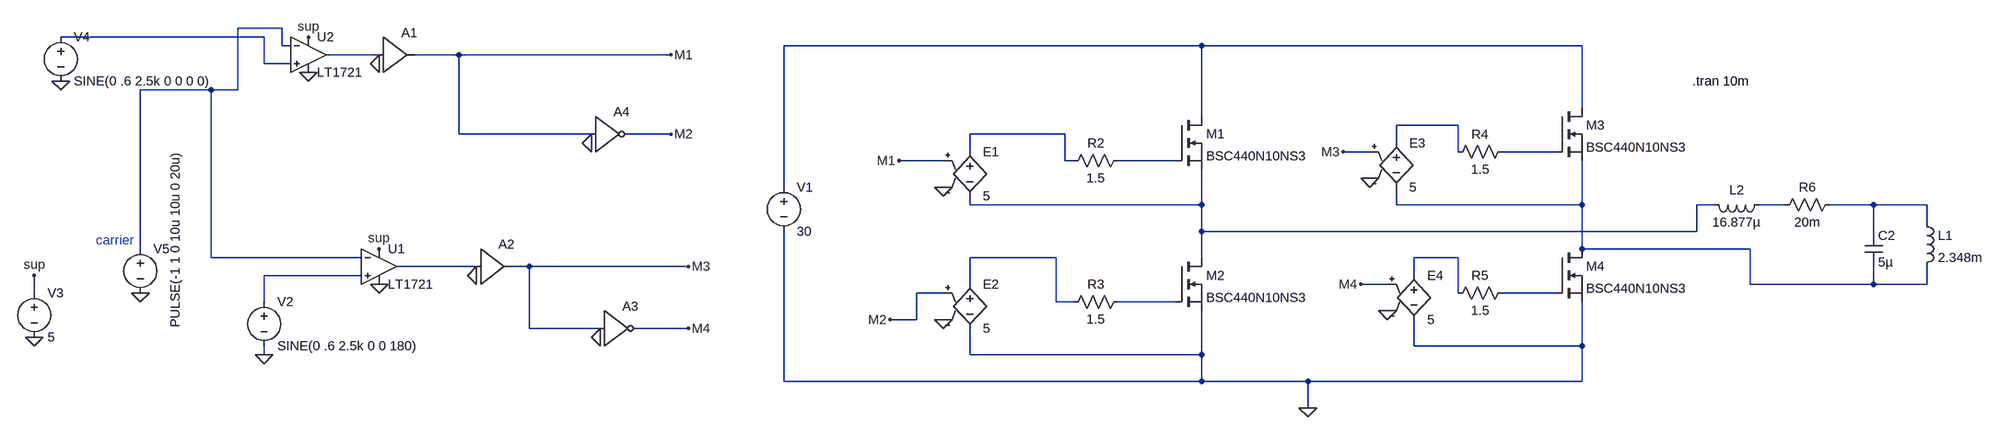
[diagram p0: schematic Class_D_Simulation.asc]
Class_D_Simulation.asc, the LTspice schematic file:
Version 4
SHEET 1 6144 680
WIRE 2576 -368 2496 -368
WIRE 2544 -352 2176 -352
WIRE 2576 -336 2576 -368
WIRE 2592 -336 2576 -336
WIRE 4464 -336 3536 -336
WIRE 5152 -336 4464 -336
WIRE 2752 -320 2656 -320
WIRE 2896 -320 2816 -320
WIRE 3280 -320 2896 -320
WIRE 2544 -304 2544 -352
WIRE 2592 -304 2544 -304
WIRE 2448 -256 2320 -256
WIRE 2496 -256 2496 -368
WIRE 2496 -256 2448 -256
WIRE 5152 -224 5152 -336
WIRE 4464 -208 4464 -336
WIRE 4928 -192 4816 -192
WIRE 2896 -176 2896 -320
WIRE 3136 -176 2896 -176
WIRE 3280 -176 3200 -176
WIRE 4208 -176 4016 -176
WIRE 4816 -160 4816 -192
WIRE 4016 -144 4016 -176
WIRE 4768 -144 4720 -144
WIRE 4928 -144 4928 -192
WIRE 5104 -144 5008 -144
WIRE 3968 -128 3888 -128
WIRE 4208 -128 4208 -176
WIRE 4224 -128 4208 -128
WIRE 4416 -128 4304 -128
WIRE 3536 -80 3536 -336
WIRE 4016 -48 4016 -64
WIRE 4464 -48 4464 -112
WIRE 4464 -48 4016 -48
WIRE 4816 -48 4816 -80
WIRE 5152 -48 5152 -128
WIRE 5152 -48 4816 -48
WIRE 5392 -48 5360 -48
WIRE 5520 -48 5472 -48
WIRE 5680 -48 5600 -48
WIRE 5776 -48 5680 -48
WIRE 5776 -16 5776 -48
WIRE 4464 0 4464 -48
WIRE 5360 0 5360 -48
WIRE 5360 0 4464 0
WIRE 5680 0 5680 -48
WIRE 2320 32 2320 -256
WIRE 5152 32 5152 -48
WIRE 5456 32 5152 32
WIRE 2448 48 2448 -256
WIRE 2720 48 2448 48
WIRE 4192 48 4016 48
WIRE 4464 48 4464 0
WIRE 4928 48 4848 48
WIRE 2928 64 2784 64
WIRE 3024 64 2992 64
WIRE 3312 64 3024 64
WIRE 2720 80 2544 80
WIRE 4848 80 4848 48
WIRE 4016 96 4016 48
WIRE 4800 96 4752 96
WIRE 5456 96 5456 32
WIRE 5680 96 5680 64
WIRE 5680 96 5456 96
WIRE 5776 96 5776 64
WIRE 5776 96 5680 96
WIRE 2128 112 2128 80
WIRE 3968 112 3920 112
WIRE 4928 112 4928 48
WIRE 5104 112 5008 112
WIRE 2544 128 2544 80
WIRE 4192 128 4192 48
WIRE 4224 128 4192 128
WIRE 4416 128 4304 128
WIRE 3920 160 3920 112
WIRE 3920 160 3872 160
WIRE 3024 176 3024 64
WIRE 3152 176 3024 176
WIRE 3312 176 3216 176
WIRE 4848 208 4848 160
WIRE 5152 208 5152 128
WIRE 5152 208 4848 208
WIRE 2544 224 2544 208
WIRE 4016 224 4016 176
WIRE 4464 224 4464 144
WIRE 4464 224 4016 224
WIRE 3536 272 3536 0
WIRE 4464 272 4464 224
WIRE 4464 272 3536 272
WIRE 4656 272 4464 272
WIRE 5152 272 5152 208
WIRE 5152 272 4656 272
WIRE 4656 320 4656 272
FLAG 2544 224 0
FLAG 2128 80 sup
FLAG 2176 -272 0
FLAG 2320 112 0
FLAG 4656 320 0
FLAG 3888 -128 M1
FLAG 4752 96 M4
FLAG 3872 160 M2
FLAG 3968 -80 0
FLAG 3968 160 0
FLAG 4768 -96 0
FLAG 4800 144 0
FLAG 2752 32 sup
FLAG 2752 96 0
FLAG 2128 192 0
FLAG 2624 -352 sup
FLAG 2624 -288 0
FLAG 2928 80 0
FLAG 4720 -144 M3
FLAG 3280 -320 M1
FLAG 3280 -176 M2
FLAG 3312 64 M3
FLAG 3312 176 M4
FLAG 2752 -304 0
FLAG 3136 -160 0
FLAG 3152 192 0
SYMBOL voltage 2128 96 R0
WINDOW 123 0 0 Left 0
WINDOW 39 0 0 Left 0
SYMATTR InstName V3
SYMATTR Value 5
SYMBOL voltage 2176 -368 R0
WINDOW 123 0 0 Left 0
WINDOW 39 0 0 Left 0
SYMATTR InstName V4
SYMATTR Value SINE(0 .6 2.5k 0 0 0 0)
SYMBOL voltage 2320 16 R0
WINDOW 123 0 0 Left 0
WINDOW 39 0 0 Left 0
WINDOW 3 64 -160 VRight 2
SYMATTR Value PULSE(-1 1 0 10u 10u 0 20u)
SYMATTR InstName V5
SYMBOL nmos 4416 -208 R0
SYMATTR InstName M1
SYMATTR Value BSC440N10NS3
SYMBOL nmos 4416 48 R0
SYMATTR InstName M2
SYMATTR Value BSC440N10NS3
SYMBOL nmos 5104 -224 R0
SYMATTR InstName M3
SYMATTR Value BSC440N10NS3
SYMBOL nmos 5104 32 R0
SYMATTR InstName M4
SYMATTR Value BSC440N10NS3
SYMBOL voltage 3536 -96 R0
WINDOW 123 0 0 Left 0
WINDOW 39 0 0 Left 0
SYMATTR InstName V1
SYMATTR Value 30
SYMBOL res 4320 -144 R90
WINDOW 0 0 56 VBottom 2
WINDOW 3 32 56 VTop 2
SYMATTR InstName R2
SYMATTR Value 1.5
SYMBOL res 4320 112 R90
WINDOW 0 0 56 VBottom 2
WINDOW 3 32 56 VTop 2
SYMATTR InstName R3
SYMATTR Value 1.5
SYMBOL res 5024 -160 R90
WINDOW 0 0 56 VBottom 2
WINDOW 3 32 56 VTop 2
SYMATTR InstName R4
SYMATTR Value 1.5
SYMBOL res 5024 96 R90
WINDOW 0 0 56 VBottom 2
WINDOW 3 32 56 VTop 2
SYMATTR InstName R5
SYMATTR Value 1.5
SYMBOL e 4016 -160 R0
SYMATTR InstName E1
SYMATTR Value 5
SYMBOL e 4016 80 R0
SYMATTR InstName E2
SYMATTR Value 5
SYMBOL e 4816 -176 R0
SYMATTR InstName E3
SYMATTR Value 5
SYMBOL e 4848 64 R0
SYMATTR InstName E4
SYMATTR Value 5
SYMBOL cap 5664 0 R0
SYMATTR InstName C2
SYMATTR Value 5µ
SYMBOL voltage 2544 112 R0
WINDOW 123 0 0 Left 0
WINDOW 39 0 0 Left 0
SYMATTR InstName V2
SYMATTR Value SINE(0 .6 2.5k 0 0 180)
SYMBOL Comparators\\LT1721 2752 0 R0
SYMATTR InstName U1
SYMBOL Comparators\\LT1721 2624 -384 R0
SYMATTR InstName U2
SYMBOL Digital\\buf1 2928 0 R0
SYMATTR InstName A2
SYMBOL Digital\\inv 3136 -240 R0
SYMATTR InstName A4
SYMBOL Digital\\buf1 2752 -384 R0
SYMATTR InstName A1
SYMBOL Digital\\inv 3152 112 R0
SYMATTR InstName A3
SYMBOL ind 5488 -64 R90
WINDOW 0 5 56 VBottom 2
WINDOW 3 32 56 VTop 2
SYMATTR InstName L2
SYMATTR Value 16.877µ
SYMBOL res 5616 -64 R90
WINDOW 0 0 56 VBottom 2
WINDOW 3 32 56 VTop 2
SYMATTR InstName R6
SYMATTR Value 20m
SYMBOL ind 5760 -32 R0
SYMATTR InstName L1
SYMATTR Value 2.348m
TEXT 5352 -272 Left 2 !.tran 10m
TEXT 2240 16 Left 2 ;carrier

The netlist it stands for:
* Class_D_Simulation.asc
V3 sup 0 5
V4 N002 0 SINE(0 .6 2.5k 0 0 0 0)
V5 N001 0 PULSE(-1 1 0 10u 10u 0 20u)
M1 N003 N008 N009 N009 BSC440N10NS3
M2 N009 N018 0 0 BSC440N10NS3
M3 N003 N007 N010 N010 BSC440N10NS3
M4 N010 N017 0 0 BSC440N10NS3
V1 N003 0 30
R2 N008 N006 1.5
R3 N018 N013 1.5
R4 N007 N005 1.5
R5 N017 N014 1.5
E1 N006 N009 M1 0 5
E2 N013 0 M2 0 5
E3 N005 N010 M3 0 5
E4 N014 0 M4 0 5
C2 N012 N010 5µ
V2 N016 0 SINE(0 .6 2.5k 0 0 180)
XU1 N016 N001 sup 0 N015 LT1720  ; LT1721, pins In+ In- V+ V- OUT
XU2 N002 N001 sup 0 N004 LT1720  ; LT1721, pins In+ In- V+ V- OUT
A2 N015 0 0 0 0 0 M3 0 BUF
A4 M1 0 0 0 0 M2 0 0 BUF
A1 N004 0 0 0 0 0 M1 0 BUF
A3 M3 0 0 0 0 M4 0 0 BUF
L2 N011 N009 16.877µ
R6 N012 N011 20m
L1 N012 N010 2.348m
.model NMOS NMOS
.model PMOS PMOS
.lib standard.mos
.tran 10m
* carrier
.lib LTC.lib
.backanno
.end